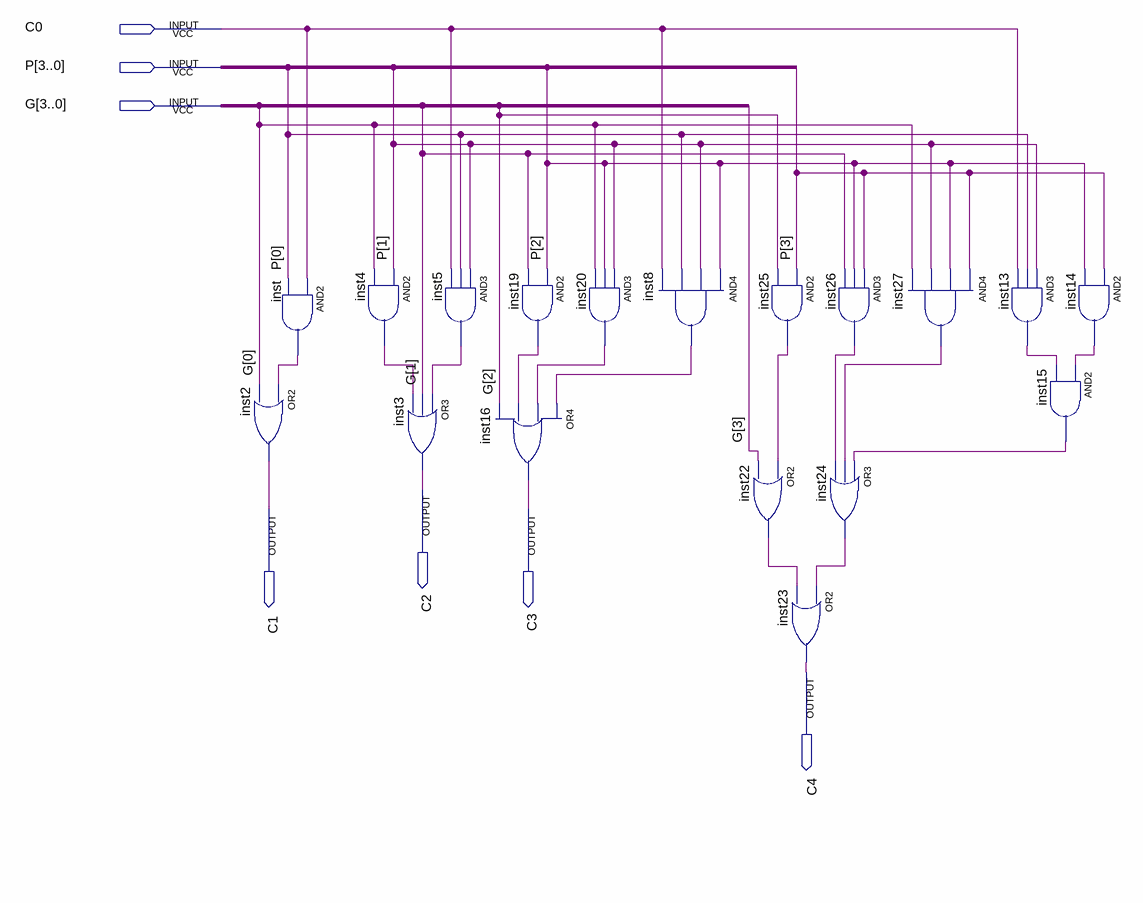
[diagram p0: schematic sheet]
// Quartus schematic clalogic.bdf as structural Verilog: 18 symbols, 7 pins
module clalogic (
  input  C0,
  input  [3:0] P,
  input  [3:0] G,
  output C2,
  output C1,
  output C3,
  output C4
);

  wire inst4_out, inst5_out, inst8_out, inst13_out, inst14_out, inst15_out, inst19_out, inst20_out,
       inst22_out, inst24_out, inst25_out, inst26_out, inst27_out, inst_out;

  or inst2 (C1, inst_out, G[0]);
  and inst (inst_out, C0, P[0]);
  and inst4 (inst4_out, P[1], G[0]);
  or inst3 (C2, inst5_out, G[1], inst4_out);
  and inst5 (inst5_out, P[1], P[0], C0);
  or inst16 (C3, inst8_out, inst20_out, inst19_out, G[2]);
  and inst19 (inst19_out, P[2], G[1]);
  and inst20 (inst20_out, P[1], P[2], G[0]);
  and inst8 (inst8_out, P[2], P[1], P[0], C0);
  and inst25 (inst25_out, P[3], G[2]);
  or inst22 (inst22_out, inst25_out, G[3]);
  or inst23 (C4, inst24_out, inst22_out);
  and inst26 (inst26_out, P[3], P[2], G[1]);
  or inst24 (inst24_out, inst15_out, inst27_out, inst26_out);
  and inst27 (inst27_out, P[3], P[2], P[1], G[0]);
  and inst13 (inst13_out, P[1], P[0], C0);
  and inst14 (inst14_out, P[3], P[2]);
  and inst15 (inst15_out, inst14_out, inst13_out);
endmodule
